# EAGLE design sensor_module_base (EAGLE 7.4.0)
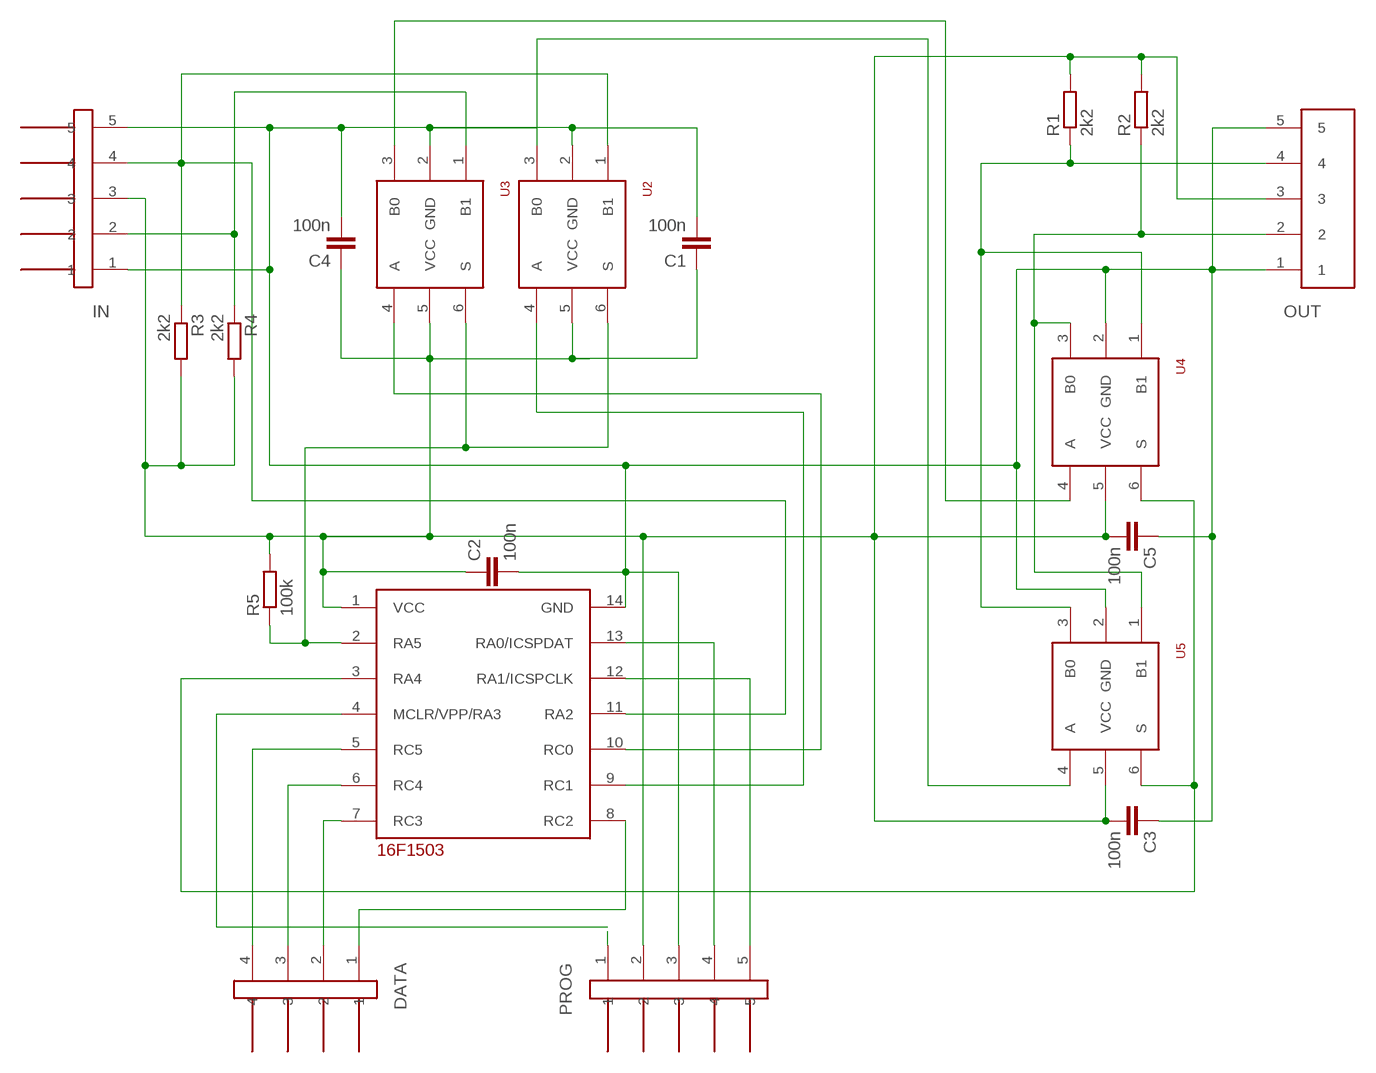
[diagram p0: schematic, sheet 1]

## Parts
C1  100n  C-EUC0603K  [C0603K]
C2  100n  C-EUC0603K  [C0603K]
C3  100n  C-EUC0603K  [C0603K]
C4  100n  C-EUC0603K  [C0603K]
C5  100n  C-EUC0603K  [C0603K]
DATA  JUMPER4M  [JUMPER4M]
IN  JUMPER5M-90  [JUMPER5M-90]
OUT  JUMPER5F-90  [JUMPER5F-90]
PROG  JUMPER5M  [JUMPER5M]
R1  2k2  R-EU_R0603  [R0603]
R2  2k2  R-EU_R0603  [R0603]
R3  2k2  R-EU_R0603  [R0603]
R4  2k2  R-EU_R0603  [R0603]
R5  100k  R-EU_R0603  [R0603]
U1  16F1503  16F103-TSSOP  [TSSOP14]
U2  NC7SB3157P6X  [SC70-6L]
U3  NC7SB3157P6X  [SC70-6L]
U4  NC7SB3157P6X  [SC70-6L]
U5  NC7SB3157P6X  [SC70-6L]

## Nets
GND: C1.2 C2.2 C3.1 C4.2 C5.1 IN.1 IN.5 OUT.1 OUT.5 PROG.3 U1.14(GND) U2.2(GND) U3.2(GND) U4.2(GND) U5.2(GND)
N$1: U1.3(RA4) U4.6(S) U5.6(S)
N$2: U1.9(RC1) U2.4(A)
N$3: DATA.2 U1.7(RC3)
N$4: U1.10(RC0) U3.4(A)
N$6: OUT.4 R1.1 U4.1(B1) U5.3(B0)
N$7: U3.3(B0) U4.4(A)
N$8: IN.2 R4.1 U3.1(B1)
N$9: R5.1 U1.2(RA5) U2.6(S) U3.6(S)
N$10: OUT.2 R2.1 U4.3(B0) U5.1(B1)
N$11: IN.4 R3.1 U1.11(RA2) U2.1(B1)
N$12: DATA.4 U1.5(RC5)
N$13: PROG.1 U1.4(MCLR/VPP/RA3)
N$14: PROG.4 U1.13(RA0/ICSPDAT)
N$15: PROG.5 U1.12(RA1/ICSPCLK)
N$17: DATA.3 U1.6(RC4)
N$18: DATA.1 U1.8(RC2)
N$20: U2.3(B0) U5.4(A)
VCC: C1.1 C2.1 C3.2 C4.1 C5.2 IN.3 OUT.3 PROG.2 R1.2 R2.2 R3.2 R4.2 R5.2 U1.1(VCC) U2.5(VCC) U3.5(VCC) U4.5(VCC) U5.5(VCC)

## Library data of the parts
C1-C5 = resistor:C-EU: CAPACITOR, European symbol
DATA = !stavebnice03:JUMPER4M
IN = !stavebnice03:JUMPER5M-90
OUT = !stavebnice03:JUMPER5F-90
PROG = !stavebnice03:JUMPER5M
R1-R5 = resistor:R-EU_: RESISTOR, European symbol
U1 = !stavebnice03:16F103-TSSOP
U2-U5 = !stavebnice03:NC7SB3157P6X

## Board
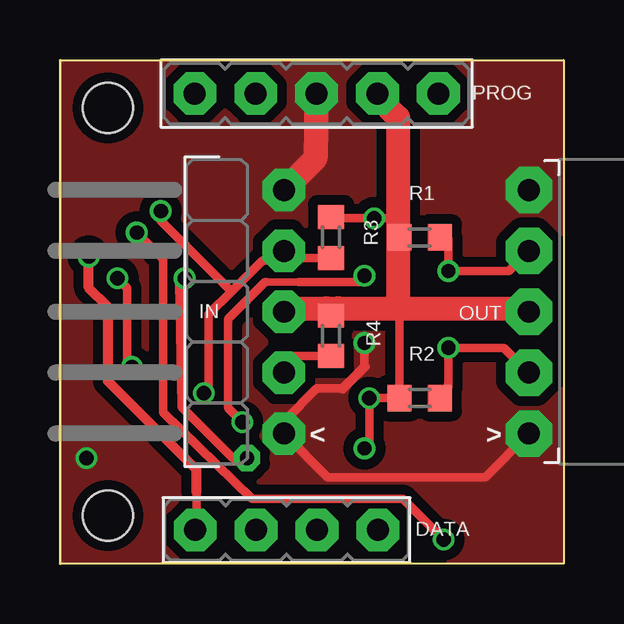
[diagram p1: board, top side]
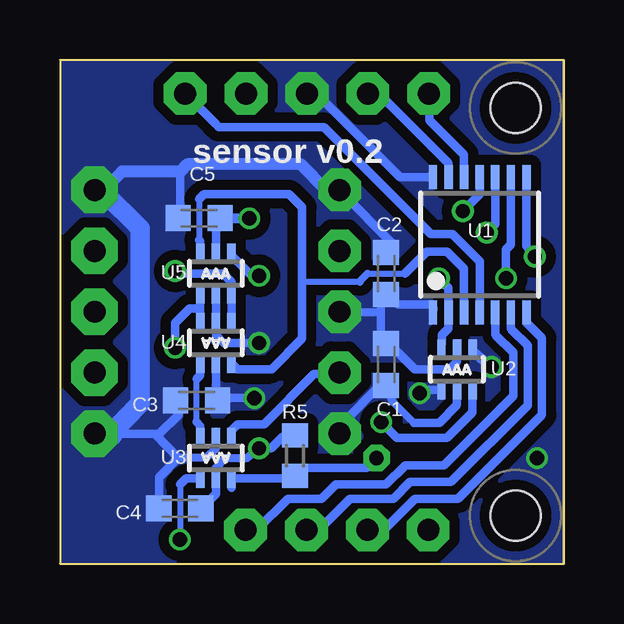
[diagram p2: board, bottom side, seen from below]

Size 21 x 21 mm. Coordinates in mm from the lower left corner, seen from the top.
Outline: 0,0 0,21 21,21 21,0 0,0
Copper layers (1*16): Top 0.035mm / dielectric 1.5mm / Bottom 0.035mm
Design rules "manabu *": minimum track width 6mil, minimum drill 12mil, track to track 6mil, track to pad 6mil, pad to pad 6mil, via to via 6mil, smd to smd 0mil, copper to edge 0mil, drill to drill 10mil, minimum pad ring 10mil, minimum via ring 6mil, stop-mask expansion 2mil, vias tented up to drill 100mil, thermal gap 10mil
Holes 2.1 mm at 2,19 2,2

### Footprints (pad centres in the part's own frame; a part is rotated, then mirrored left to right if it is on the bottom)
C0603K = smd 1.05 x 1.08: 1 -0.875,0; 2 0.875,0
JUMPER4M = drill 0.914 pad 1.778 octagon: 1 -3.81,0; 2 -1.27,0; 3 1.27,0; 4 3.81,0
JUMPER5M-90 = drill 0.914 pad 1.778 octagon: 1 -5.08,-2.54; 2 -2.54,-2.54; 3 0,-2.54; 4 2.54,-2.54; 5 5.08,-2.54
JUMPER5F-90 = drill 0.914 pad 1.93 octagon: 1 5.08,-2.54; 2 2.54,-2.54; 3 0,-2.54; 4 -2.54,-2.54; 5 -5.08,-2.54
JUMPER5M = drill 0.914 pad 1.778 octagon: 1 -5.08,0; 2 -2.54,0; 3 0,0; 4 2.54,0; 5 5.08,0
R0603 = smd 1 x 1.1: 1 -0.85,0; 2 0.85,0
TSSOP14 = smd 0.35 x 1: 1 -1.95,-2.825; 2 -1.3,-2.825; 3 -0.65,-2.825; 4 0,-2.825; 5 0.65,-2.825; 6 1.3,-2.825; 7 1.95,-2.825; 8 1.95,2.825; 9 1.3,2.825; 10 0.65,2.825; 11 0,2.825; 12 -0.65,2.825; 13 -1.3,2.825; 14 -1.95,2.825
SC70-6L = smd 0.35 x 0.8: 1 -0.65,-0.85; 2 0,-0.85; 3 0.65,-0.85; 4 0.65,0.85; 5 0,0.85; 6 -0.65,0.85

### Placement (x,y rotation side)
C1  7.4,8.3 270 bottom
C2  7.4,12.1 90 bottom
C3  15.3,6.8 0 bottom
C4  16,2.3 180 bottom
C5  15.2,14.4 0 bottom
DATA  9.45,1.4 0 top
IN  6.8,10.5 90 top
OUT  22.1,10.5 270 top
PROG  10.7,19.6 180 top
R1  15,13.6 180 top
R2  15,6.9 180 top
R3  11.3,13.6 90 top
R4  11.3,9.5 90 top
R5  11.2,4.5 90 bottom
U1  3.5,13.3 0 bottom
U2  4.45,8.1 0 bottom
U3  14.5,4.4 180 bottom
U4  14.5,9.2 180 bottom
U5  14.5,12.1 0 bottom

### Tracks (layer width: path | path; a pad name or v marks a point on that pad's centre or on a via)
GND  (via drill 0.6)
  Top 0.356: 19.7,5.38 OUT.1 17.74,3.6 11.16,3.6 IN.1 9.4,5.48 9.4,6 10.7,7.3 11.8,7.3 | v12.7,9.2 12.7,8.2
  Top 0.406: 11.8,7.3 12.7,8.2
  Top 1: PROG.3 10.65,16.89 IN.5
  Bottom 0.305: 6.25,5.87 7.14,6.77
  Bottom 0.33: 14.5,4.8 14.9,4.4
  Bottom 0.34: U3.2 14.5,4.8 | 14.9,4.4 16.07,4.4
  Bottom 0.356: U5.2 U4.2 14.49,9.53 14.17,9.2 v12.7,9.2 | C3.1 16.06,6.21 16.87,5.4 17.03,5.4 | 17.03,5.4 18.89,5.4 | 17.03,5.4 16.07,4.4 16.88,3.6 C4.2 | U2.2 4.45,6.61 5.18,5.87 6.25,5.87 | 7.14,6.77 C1.2 7.68,7.41 9.21,5.87 IN.1 | C2.2 7.04,13.23 IN.5 | C5.1 16,14.35 16,16.35 | U1.14 6.83,16.12 10.3,19.6 PROG.3
  Bottom 0.5: 15.68,16.65 10.95,16.65 9.88,15.58 | 15.68,16.65 16,16.35 18.41,16.35 19.27,15.5 | 15.97,16.35 15.68,16.65
  Bottom 0.8: 17.66,13.97 19.19,15.5 19.27,15.5 19.6,15.5
  Bottom 0.813: 17.66,13.97 17.66,6.67 18.89,5.4
  Bottom 1.016: 18.89,5.4 OUT.1
  other vias: 1.1,4.4
  pour Top (isolate 0.42, rank 3, no thermals): 0.1,0.1 0.1,20.9 20.9,20.9 20.9,0.1
  pour Bottom (isolate 0.43, rank 2, no thermals): 0.1,0.1 0.1,20.9 20.9,20.9 20.9,0.1
N$1
  Bottom 0.254: 8.18,12.1 6.61,12.1 | 8.5,11.75 10.9,11.75 | 15.2,15.2 15.2,13.5
  Bottom 0.304: 8.5,11.75 8.5,11.78
  Bottom 0.305: 8.5,11.78 8.18,12.1
  Bottom 0.356: U1.3 4.15,12.3 4.86,13.02 5.69,13.02 6.61,12.1 | U4.6 13.6,8.1 12.18,8.1 10.9,9.38 10.9,11.75 10.91,11.75 10.91,14.86 11.44,15.4 15,15.4 15.2,15.2 | U5.6 15.15,13.45 15.2,13.5
N$2  (via drill 0.6)
  Top 0.356: v3,8.2 2.8,8.4 2.8,11.5 v2.4,11.9
  Bottom 0.356: U2.4 3.71,8.79 | U1.9 2.2,13.3 2.4,13.1 v2.4,11.9
  Bottom 0.406: 3.71,8.79 v3,8.2
  pour Bottom (isolate 0.356, no thermals): 2.6,6.64 3.87,6.64 3.97,9.37 2.7,9.37
N$3
  Bottom 0.356: 1.55,10.25 U1.7 1.55,10.05 0.9,9.4 0.9,6.2 | 4.4,2.7 6.2,2.7 7.5,1.4 DATA.2
  Bottom 0.357: 0.9,6.2 4.4,2.7
N$4  (via drill 0.6)
  Top 0.356: v3.2,13.8 4.3,12.7 4.3,6.3 8,2.7 | 13.8,2.7 14.3,2.7 v16,1
  Top 0.357: 13.8,2.7 8,2.7
  Bottom 0.254: 16,3.3 v16,1
  Bottom 0.356: v3.2,13.8 2.85,14.15 U1.10 | U3.4 15.75,3.55 16,3.3
N$6  (via drill 0.6)
  Top 0.356: OUT.4 19.57,13.06 18.71,12.2 v16.2,12.2 16.2,13.55 R1.1
  Bottom 0.356: U4.1 U5.3 13.85,11.74 14.21,12.1 16.12,12.1 v16.2,12.2
N$7
  Bottom 0.254: 15.3,5.9 15.3,7.7
  Bottom 0.356: U4.4 15.15,7.84 15.3,7.7 | U3.3 15.15,5.75 15.3,5.9
N$8
  Top 0.357: R4.1 9.35,8.65 IN.2
  Bottom 0.356: U3.1 13.85,5.55 13.6,5.8 12.5,5.8 10.4,7.9 9.4,7.9 IN.2
N$9  (via drill 0.6, 0.6 pad 1.1)
  Top 0.356: v5.2,11.9 4.96,11.76 5.06,6.54 7.2,4.4 v7.8,4.4
  Bottom 0.356: v5.2,11.9 4.8,11.5 U1.2 4.8,9.8 5.08,9.53 5.08,9.28 U2.6 | 13.85,3.15 U3.6 11.6,3.55 R5.1 | 11.25,3.6 R5.1 | R5.1 11.05,3.9 10.9,3.9 10.8,4 8.2,4 v7.8,4.4
N$10  (via drill 0.6)
  Top 0.356: 16.18,7.43 R2.1 16.2,7.35 v16.2,9 18.5,9 19.54,7.96 OUT.2
  Bottom 0.356: v16.2,9 16.2,10.04 15.6,10.64 15.19,10.64 15.15,10.6 | U5.1 15.15,10.6 | 15.15,10.6 U4.3
N$11  (via drill 0.6)
  Top 0.356: 7.15,11.35 8.44,12.64 8.94,12.64 IN.4 9.63,12.75 R3.1 | 7.15,11.35 6.2,10.4 6.2,7.3 v6,7.1 | v4.2,14.7 4.2,14.3 7.15,11.35
  Bottom 0.356: U2.1 5.65,7.25 v6,7.1 | U1.11 3.5,15.4 v4.2,14.7
  pour Bottom (isolate 0.356, no thermals): 4.9,7.6 4.9,6.6 5.1,6.4 6.2,6.4 6.5,6.7 6.5,7.6
N$12
  Bottom 0.356: U1.5 2.85,9.55 2.82,9.52 | 2.1,7 5,4.1 6.6,4.1 7.4,3.3 9.5,3.3 10.1,2.7 11.5,2.7 12.8,1.4 DATA.4
  Bottom 0.357: 2.1,7 2.1,8.8 2.82,9.52
N$13
  Bottom 0.35: 14.5,18.32 PROG.1
  Bottom 0.356: U1.4 3.5,12.61 3.51,12.61 4.64,13.74 5.54,13.74 10,18.2 14.38,18.2 14.5,18.32
N$14
  Bottom 0.356: U1.13 4.8,16.7 7.6,19.5 8.06,19.5 PROG.4
N$15
  Bottom 0.356: U1.12 4.15,17.05 5.6,18.5 5.6,19.63 PROG.5
N$17
  Bottom 0.356: 1.5,6.92 1.5,6.6 4.7,3.4 6.4,3.4 7.1,2.7 8.9,2.7 10.2,1.4 DATA.3 | U1.6 2.2,9.8 2.17,9.77
  Bottom 0.357: 2.17,9.77 1.5,9.1 1.5,6.92
N$18  (via drill 0.6)
  Top 0.35: 5.69,3.01 5.69,1.35 DATA.1
  Top 0.406: 5.69,3.01 5.69,3.91 2,7.6 2,10.7 1.2,11.5 v1.2,12.8
  Bottom 0.356: U1.8 1.55,13.25 v1.2,12.8
N$20  (via drill 0.6)
  Top 0.305: 8.61,11.75 9.95,11.75
  Top 0.356: 8.61,11.75 8.55,11.75 7,10.2 7,6.5 v7.6,5.9 | 9.95,11.75 12.45,11.75 v12.7,12
  Bottom 0.356: U2.3 3.79,6.31 4.86,5.24 6.94,5.24 v7.6,5.9 | U5.4 13.85,12.85 13,12 v12.7,12
VCC  (via drill 0.6)
  Top 0.356: v12.7,4.8 12.9,5 v12.9,6.9 R2.2 14.15,10.44 | R3.2 11.55,14.45 | 11.7,14.3 11.25,14.6 R3.2 | R4.2 11.3,10.44 11.1,10.64 | 11.6,10.64 11.54,10.64 11.4,10.5 14.09,10.5 14.15,10.44 | 14.15,10.44 14.15,10.65 14.1,10.7 | R1.2 14.1,13.25 14.1,14.2 13.9,14.4 v13.1,14.4 11.35,14.4 R3.2
  Top 0.357: R4.2 11.5,10.54 11.6,10.64
  Top 0.813: 9.37,10.48 9.53,10.64
  Top 1: 9.53,10.64 11.1,10.64 11.6,10.64 19.42,10.64 OUT.3 | 14.1,10.7 14.1,13.25 14.1,18.6 13.24,19.46 PROG.2
  Top 1.27: IN.3 9.37,10.48
  Bottom 0.33: 14.5,4 14.1,4.4
  Bottom 0.34: 14.1,4.4 13.2,4.4 | U3.5 14.5,4
  Bottom 0.356: IN.3 7.62,10.48 | 7.62,10.48 7.62,10.92 C2.1 6.91,10.79 5.56,10.79 5.42,10.66 U1.1 | 7.62,10.48 7.62,9.11 C1.1 7.41,8.89 6.99,8.89 6.19,8.1 4.76,8.1 4.45,8.41 U2.5 | U4.5 14.5,6.95 C3.2 14.22,7 14,6.9 v12.9,6.9 | 13.2,4.4 v12.7,4.8 12.2,4.8 11.7,5.3 11.25,5.3 R5.2 | C4.1 15.1,2.3 14.5,2.9 U3.5 | U5.5 14.5,14.32 C5.2
  Bottom 0.406: C5.2 v13.1,14.4
  pour Bottom (isolate 0.42, no thermals): 5.56,11.75 9.63,11.75 10.4,11.69 10.4,9.2 8.8,9.2 7.9,8.3 5.56,8.3
  pour Bottom (isolate 0.406, no thermals): 14.61,6.15 12.96,6.15 11.49,7.52 14.58,7.52

### Text on the board
Top: II=I+I
Bottom: II=I+I
Dimension: sensor base
bPlace: sensor v0.2
bValues: RA1 | RA0 | GND | VCC | RA3 | FLASH | RC2 | RC3 | RC4 | RC5